# Altium schematic sheet 2017_CHECK UP LED.SchDoc
size A4
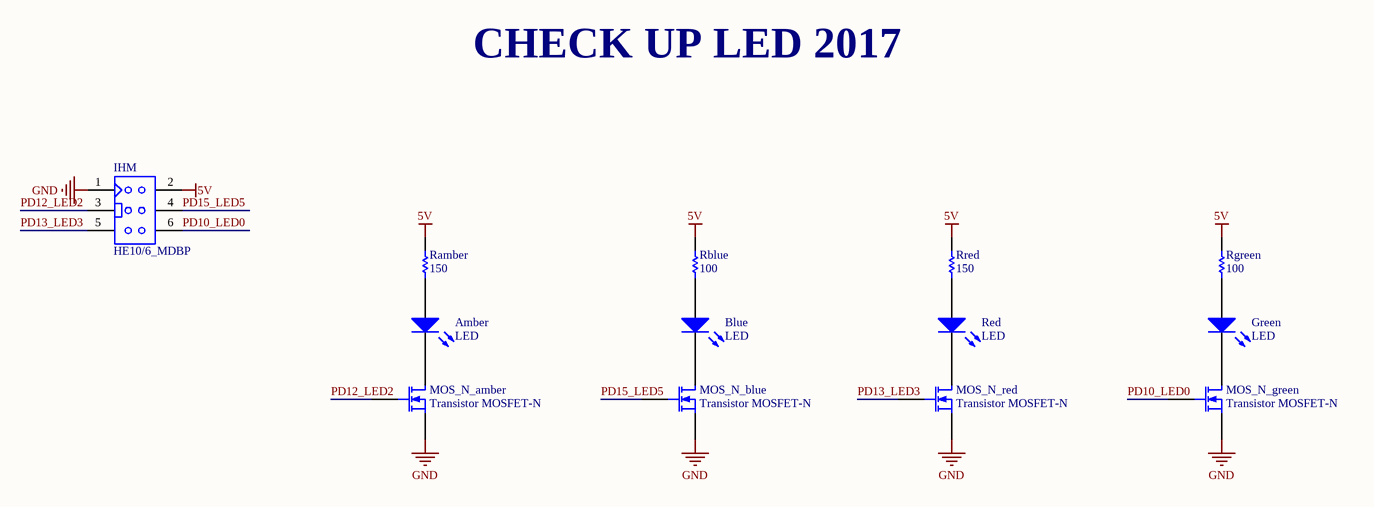
[diagram p0: 2017_CHECK UP LED.SchDoc]

## Parts
Amber  LED  [LED_1206]
Blue  LED  [LED_1206]
Green  LED  [LED_1206]
IHM  Type: HE10/6_MDBP  [HE10/6_M_D_BP]  (hidden comment: HE10/6_MALE_DROIT_BAS PROFIL)
MOS_N_amber  Transistor MOSFET-N  [SOT23-3N]
MOS_N_blue  Transistor MOSFET-N  [SOT23-3N]
MOS_N_green  Transistor MOSFET-N  [SOT23-3N]
MOS_N_red  Transistor MOSFET-N  [SOT23-3N]
Ramber  150  [R1206_N]
Rblue  100  [R1206_N]
Red  LED  [LED_1206]
Rgreen  100  [R1206_N]
Rred  150  [R1206_N]

## Nets
5V: IHM.2 Ramber.2 Rblue.2 Rgreen.2 Rred.2
GND: IHM.1 MOS_N_amber.2(S) MOS_N_blue.2(S) MOS_N_green.2(S) MOS_N_red.2(S)
PD10_LED0: IHM.6 MOS_N_green.1(G)
PD12_LED2: IHM.3 MOS_N_amber.1(G)
PD13_LED3: IHM.5 MOS_N_red.1(G)
PD15_LED5: IHM.4 MOS_N_blue.1(G)
NetAmber_1: Amber.1(A) Ramber.1
NetAmber_2: Amber.2(K) MOS_N_amber.3(D)
NetBlue_1: Blue.1(A) Rblue.1
NetBlue_2: Blue.2(K) MOS_N_blue.3(D)
NetGreen_1: Green.1(A) Rgreen.1
NetGreen_2: Green.2(K) MOS_N_green.3(D)
NetMOS_N_red_3: MOS_N_red.3(D) Red.2(K)
NetRed_1: Red.1(A) Rred.1

## Notes on the sheet
- CHECK UP LED 2017
- Title
- Size:
- Date:
- A4
- Number:
- Time:
- Revision:
- Sheet
- of
- File:

## Library data of the parts
Amber Blue Green Red = LED: Typical LED; Published: 8-Jun-2000; LatestRevisionDate: 08-Jul-2005; LatestRevisionNote: Mech Layer 1 removed.; PackageReference: LED-1; Publisher: Altium Limited
IHM = HE10/6_MALE_DROIT_BAS PROFIL: EMBASE HE10/6 MALE DROIT BAS PROFIL
MOS_N_amber MOS_N_blue MOS_N_green MOS_N_red = Transistor MOSFET-N: N-Channel MOSFET; PackageDocument: 1995/1996; Published: 8-Jun-2000; LatestRevisionDate: 17-Jul-2002; LatestRevisionNote: Re-released for DXP Platform.; PackageReference: E3; Publisher: Altium Limited
Ramber Rblue Rgreen Rred = Resistor: Published: 8-Jun-2000; LatestRevisionDate: 17-Jul-2002; LatestRevisionNote: Re-released for DXP Platform.; PackageReference: AXIAL-0.5; Publisher: Altium Limited